# Altium schematic sheet EasyP16F1455.SchDoc
size A4
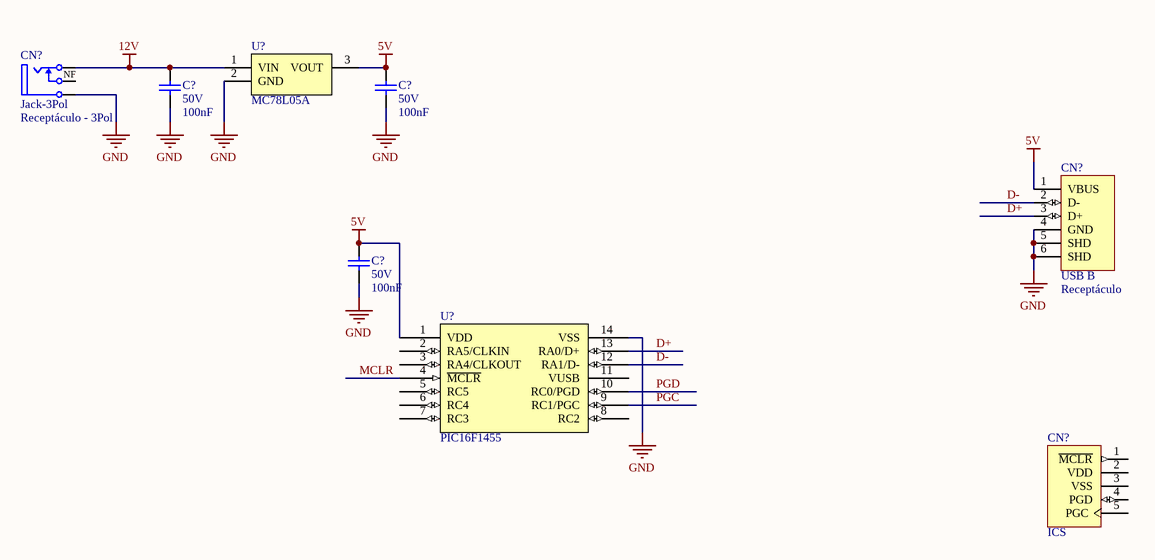
[diagram p0: EasyP16F1455.SchDoc]

## Parts
(Parts that share a designator on the sheet are numbered #1, #2 ... from top to bottom, then left to right.)
C?#1  value 100nF  Tensão: 50V  [CC0603]  (hidden comment: Capacitor Cerâmico)
C?#2  value 100nF  Tensão: 50V  [CC0603]  (hidden comment: Capacitor Cerâmico)
C?#3  value 100nF  Tensão: 50V  [CC0603]  (hidden comment: Capacitor Cerâmico)
CN?#1  Jack-3Pol  value Receptáculo - 3Pol  [CONN_JACK-FONTE_3N]
CN?#2  USB B  value Receptáculo  [CONN_USB-B_RCPT-H]
CN?#3  ICS  [CONN HDR1X5]
U?#1  MC78L05A  [SOT-89-3N]
U?#2  PIC16F1455  [SOIC-14N]

## Nets
5V: C?#2.2 C?#3.2 CN?#2.1(VBUS) U?#1.3(VOUT) U?#2.1(VDD)
12V: C?#1.2 CN?#1.1(Centro) U?#1.1(VIN)
GND: C?#1.1 C?#2.1 C?#3.1 CN?#1.2(Malha) CN?#2.4(GND) CN?#2.5(SHD) CN?#2.6(SHD) U?#1.2(GND) U?#2.14(VSS)
D+: CN?#2.3(D+) U?#2.13(RA0/D+)
D-: CN?#2.2(D-) U?#2.12(RA1/D-)
MCLR: U?#2.4(~{MCLR})
PGC: U?#2.9(RC1/PGC)
PGD: U?#2.10(RC0/PGD)

Not connected (* = marked no-connect by the designer): CN?#1 3(NF); CN?#3 1(~{MCLR}) 2(VDD) 3(VSS) 4(PGD) 5(PGC); U?#2 2(RA5/CLKIN) 3(RA4/CLKOUT) 5(RC5) 6(RC4) 7(RC3) 8(RC2) 11(VUSB)

## Library data of the parts
C?#1-C?#3 = Cap 100nF 50V 0603 X7R: Capacitor (Semiconductor SIM Model); Chinês: Local; ChinesePrice: 0,00250; Corrente: *A; Potência: *W; Obs:: X7R; Tolerância: ±10%; Supplier 1: Digi-Key; Supplier Part Number 1: 1276-1000-1-ND; ComponentLink1Description: Datasheet; ComponentLink1URL: D:\Tecnoclade\Datasheet\!DataMissing.pdf
CN?#1 = Jack-3Pol: Jack Socket, Thru-Hole, Vertical, 2 Conductors, 3 Contacts Single Switch, Normally Closed; ChinesePrice: 0,06600; Chinês: Local; Corrente: 2.5A; Tensão: 16VDC; Supplier 1: Digi-Key; Potência: *; Obs:: *; Tolerância: *; ComponentLink1Description: Datasheet; ComponentLink1URL: D:\Tecnoclade\Datasheet\!DataMissing.pdf; Supplier Part Number 1: CP-002A-ND
CN?#2 = USB B RCPT-H: Conector Jack USB B, Through Hole, Right Angle, Horizontal; ChinesePrice: 0,00000; Chinês: ----; Obs:: USB 2.0; Corrente: *; Potência: *; Supplier 1: Digi-Key; Supplier Part Number 1: A31725-ND; Tensão: *; Tolerância: *; ComponentLink1Description: Datasheet; ComponentLink1URL: D:\Tecnoclade\Datasheet\!DataMissing.pdf
CN?#3 = Header 5 ICS: Header, 5-Pin; ChinesePrice: 0,10000; Chinês: Proved - Local; Value: Barra de 40 pinos - ATENÇÃO; Corrente: *; Potência: *; Supplier 1: Digi-Key; Supplier Part Number 1: A26509-40-ND; Tensão: *; Obs:: *; Tolerância: *; ComponentLink1Description: Datasheet; ComponentLink1URL: D:\Tecnoclade\Datasheet\!DataMissing.pdf
U?#1 = MC78L05: Regulador Linear 5V; Chinês: -----; Corrente: 100mA; ChinesePrice: 0,00000; Potência: *; Value: *; Supplier 1: Digi-Key; Supplier Part Number 1: MC78L05ACHXCT-ND; Tensão: 5V; Obs:: *; Tolerância: *; ComponentLink1Description: Datasheet; ComponentLink1URL: D:\Tecnoclade\Datasheet\
U?#2 = PIC16F1455: Microcontrolador PIC; ChinesePrice: 0,00000; Chinês: ----; Tensão: 2V3 ~ 5V5; Value: 8 Bits; Obs:: 48MHz; Corrente: *; Potência: *; Supplier 1: Digi-Key; Supplier Part Number 1: PIC16F1455-I/SL-ND; Tolerância: *; ComponentLink1Description: Datasheet; ComponentLink1URL: D:\Tecnoclade\Datasheet\PIC16F1455.pdf